# EAGLE design module_4dig7seg (EAGLE 9.6.2)
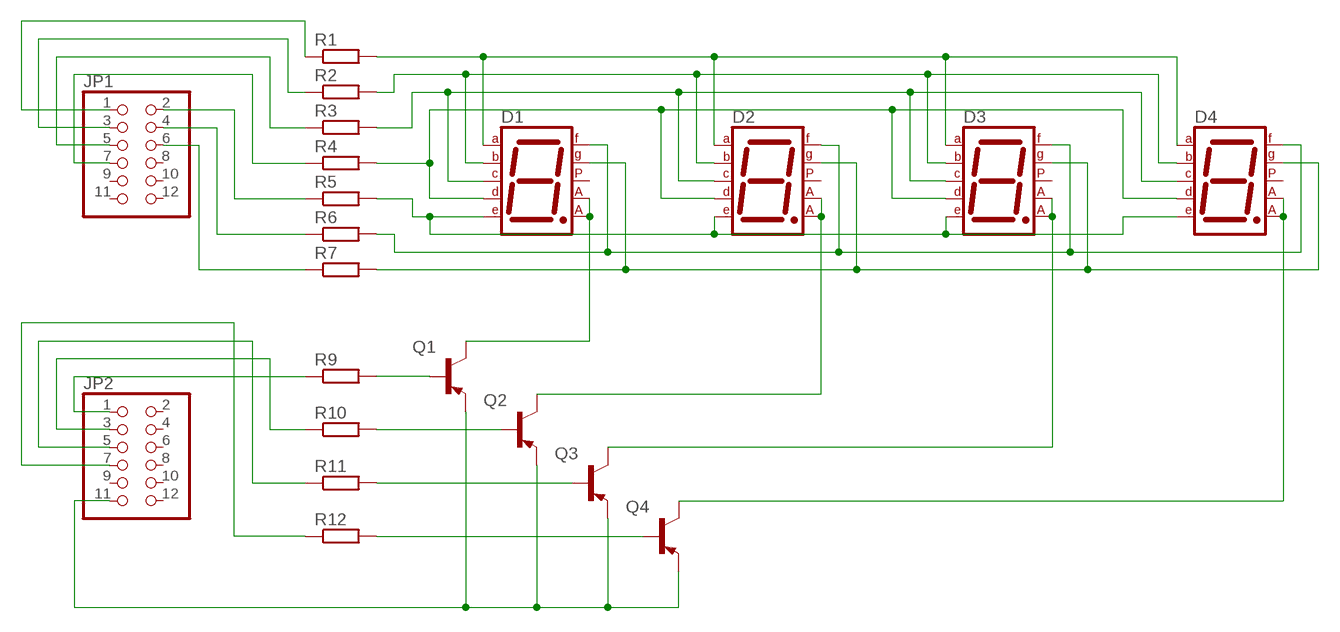
[diagram p0: schematic, sheet 1]

## Parts
D1  7SEG-CA  [7SEG-13]
D2  7SEG-CA  [7SEG-13]
D3  7SEG-CA  [7SEG-13]
D4  7SEG-CA  [7SEG-13]
JP1  PINHD-2X6/90  [2X06/90]
JP2  PINHD-2X6/90  [2X06/90]
Q1  2N3906  [TO92]
Q2  2N3906  [TO92]
Q3  2N3906  [TO92]
Q4  2N3906  [TO92]
R1  R-EU_0204/7  [0204/7]
R2  R-EU_0204/7  [0204/7]
R3  R-EU_0204/7  [0204/7]
R4  R-EU_0204/7  [0204/7]
R5  R-EU_0204/7  [0204/7]
R6  R-EU_0204/7  [0204/7]
R7  R-EU_0204/7  [0204/7]
R9  R-EU_0204/7  [0204/7]
R10  R-EU_0204/7  [0204/7]
R11  R-EU_0204/7  [0204/7]
R12  R-EU_0204/7  [0204/7]

## Nets
N$1: Q1.2(B) R9.2
N$2: Q2.2(B) R10.2
N$3: Q3.2(B) R11.2
N$4: Q4.2(B) R12.2
N$5: JP2.7 R12.1
N$6: JP2.1 R9.1
N$7: JP2.3 R10.1
N$8: JP2.5 R11.1
N$9: JP2.11 Q1.3(E) Q2.3(E) Q3.3(E) Q4.3(E)
N$10: JP1.7 R4.1
N$11: JP1.5 R3.1
N$12: JP1.3 R2.1
N$13: JP1.1 R1.1
N$14: JP1.2 R5.1
N$15: JP1.4 R6.1
N$16: JP1.6 R7.1
N$17: D1.3(CA1) D1.8(CA2) Q1.1(C)
N$18: D1.7(A) D2.7(A) D3.7(A) D4.7(A) R1.2
N$19: D3.3(CA1) D3.8(CA2) Q3.1(C)
N$20: D1.2(D) D2.2(D) D3.2(D) D4.2(D) R4.2
N$21: D1.4(C) D2.4(C) D3.4(C) D4.4(C) R3.2
N$22: D1.1(E) D2.1(E) D3.1(E) D4.1(E) R5.2
N$23: D1.9(F) D2.9(F) D3.9(F) D4.9(F) R6.2
N$24: D1.6(B) D2.6(B) D3.6(B) D4.6(B) R2.2
N$27: D1.10(G) D2.10(G) D3.10(G) D4.10(G) R7.2
N$28: D2.3(CA1) D2.8(CA2) Q2.1(C)
N$30: D4.3(CA1) D4.8(CA2) Q4.1(C)
Unconnected: D1.5(DP) D2.5(DP) D3.5(DP) D4.5(DP) JP1.8 JP1.9 JP1.10 JP1.11 JP1.12 JP2.2 JP2.4 JP2.6 JP2.8 JP2.9 JP2.10 JP2.12

## Library data of the parts
D1-D4 = special:7SEG-CA: 7-segment DISPLAY single anode, 13 mm
JP1 JP2 = pinhead:PINHD-2X6: PIN HEADER
Q1-Q4 = transistor-pnp:2N3906: PNP Transistor
R1-R7 R9-R12 = rcl:R-EU_: RESISTOR, European symbol; SPICEPREFIX: R

## Board
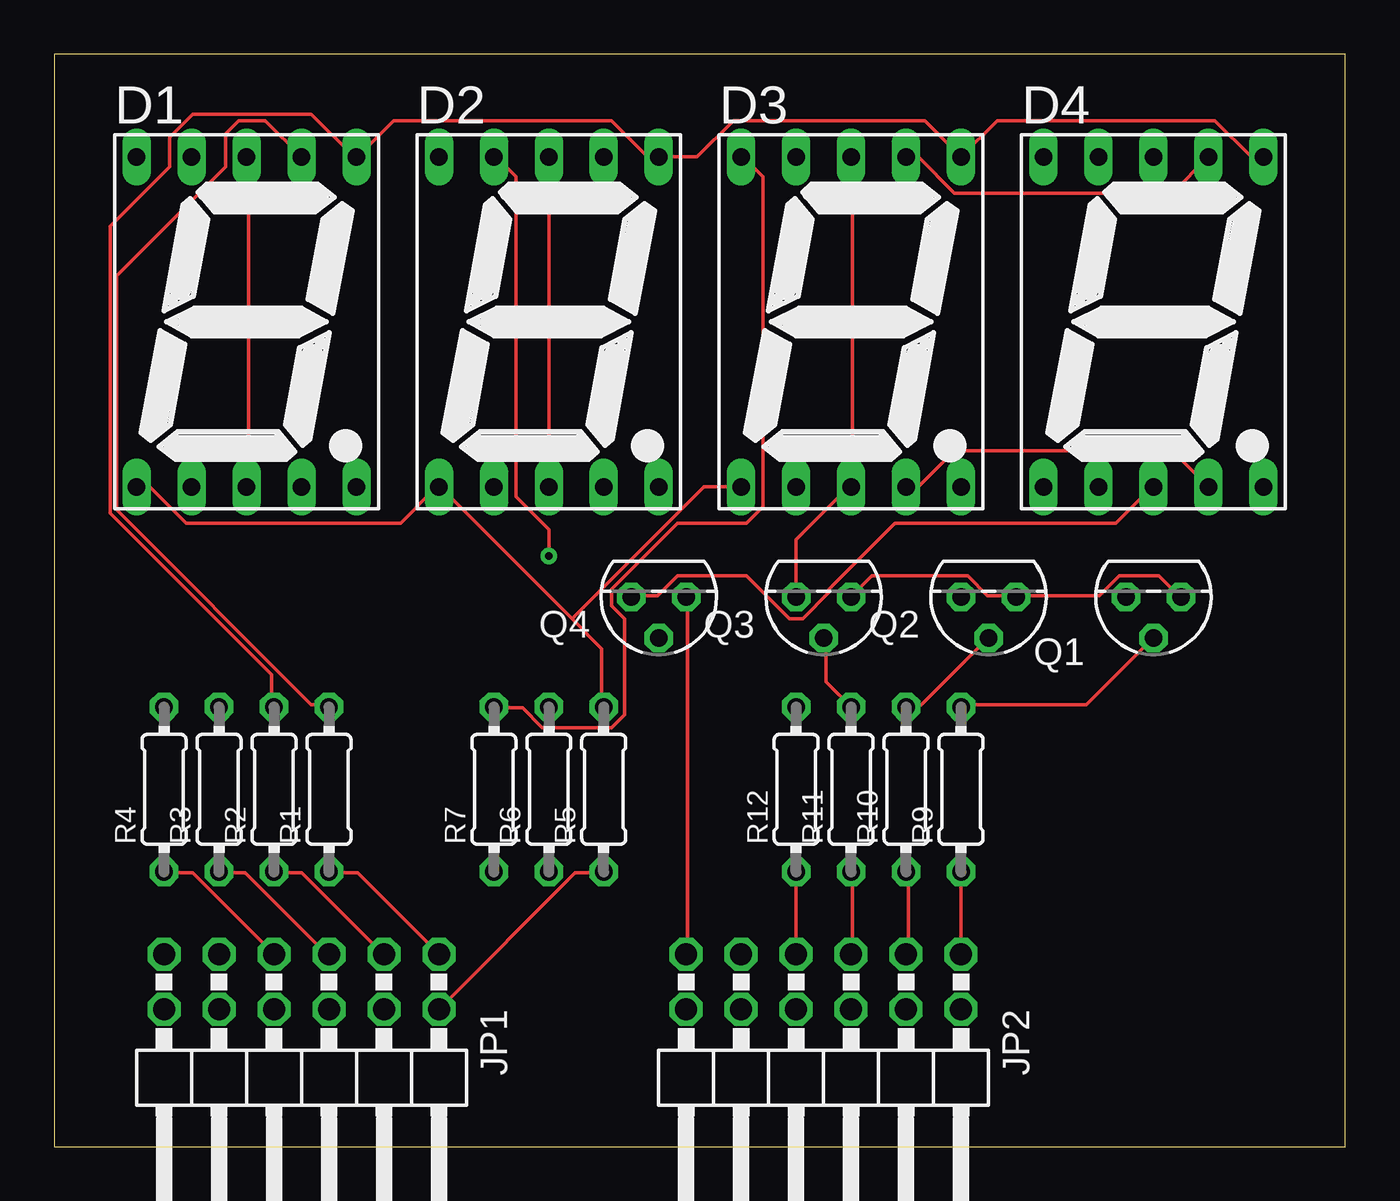
[diagram p1: board, top side]
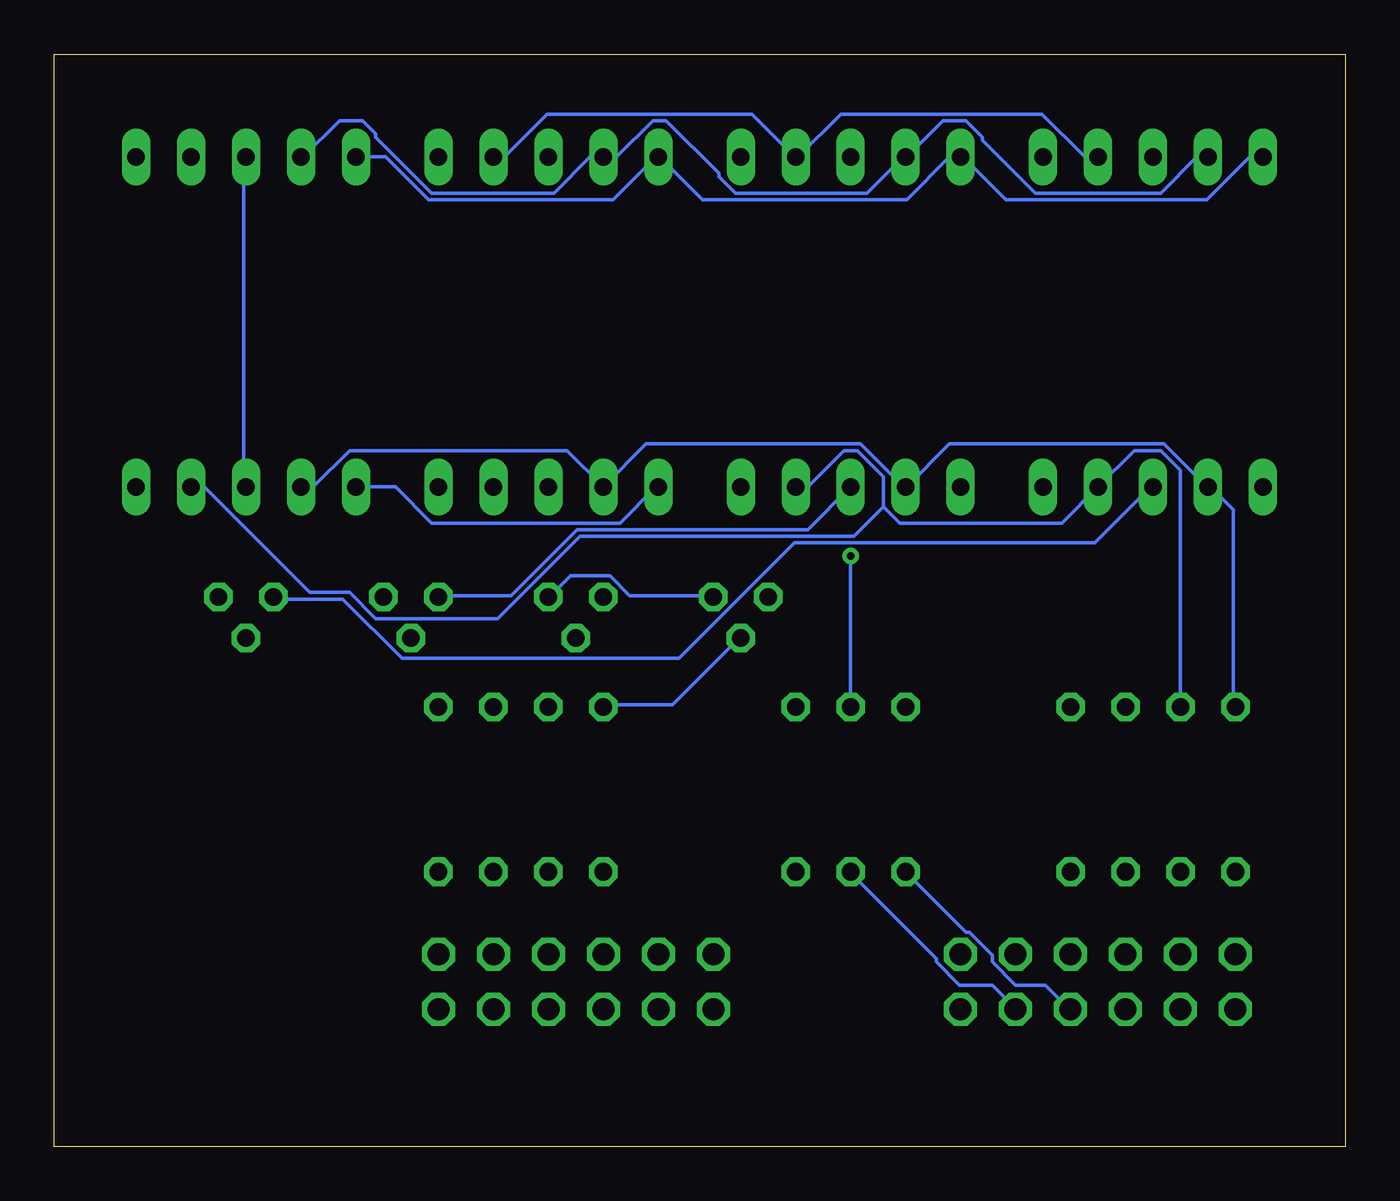
[diagram p2: board, bottom side, seen from below]

Size 59.67 x 50.47 mm. Coordinates in mm from the lower left corner, seen from the top.
Outline: 0,0 59.67,0 59.67,50.47 0,50.47 0,0
Copper layers (1*16): Top 0.035mm / dielectric 1.5mm / Bottom 0.035mm
Design rules "default": minimum track width 6mil, minimum drill 0.35mm, track to track 6mil, track to pad 6mil, pad to pad 6mil, via to via 6mil, smd to smd 6mil, copper to edge 40mil, drill to drill 6mil, minimum pad ring 10mil, minimum via ring 8mil, stop-mask expansion 4mil, vias tented up to drill 0mil, thermal gap 10mil

### Footprints (pad centres in the part's own frame; a part is rotated, then mirrored left to right if it is on the bottom)
7SEG-13 = drill 0.813 long: 1 -5.08,-7.62; 2 -2.54,-7.62; 3 0,-7.62; 4 2.54,-7.62; 5 5.08,-7.62; 6 5.08,7.62; 7 2.54,7.62; 8 0,7.62; 9 -2.54,7.62; 10 -5.08,7.62
2X06/90 = drill 1.016 octagon: 1 -6.35,-6.35; 2 -6.35,-3.81; 3 -3.81,-6.35; 4 -3.81,-3.81; 5 -1.27,-6.35; 6 -1.27,-3.81; 7 1.27,-6.35; 8 1.27,-3.81; 9 3.81,-6.35; 10 3.81,-3.81; 11 6.35,-6.35; 12 6.35,-3.81
TO92 = drill 0.813 octagon: 1 1.27,0; 2 0,1.905; 3 -1.27,0
0204/7 = drill 0.813 octagon: 1 -3.81,0; 2 3.81,0

### Placement (x,y rotation side)
D1  8.89,38.1 0 top
D2  22.86,38.1 0 top
D3  36.83,38.1 0 top
D4  50.8,38.1 0 top
JP1  11.43,2.54 180 top
JP2  35.56,2.54 180 top
Q1  50.8,25.4 180 top
Q2  43.18,25.4 180 top
Q3  35.56,25.4 180 top
Q4  27.94,25.4 180 top
R1  12.7,16.51 90 top
R2  10.16,16.51 90 top
R3  7.62,16.51 90 top
R4  5.08,16.51 90 top
R5  25.4,16.51 90 top
R6  22.86,16.51 90 top
R7  20.32,16.51 90 top
R9  41.91,16.51 90 top
R10  39.37,16.51 90 top
R11  36.83,16.51 90 top
R12  34.29,16.51 90 top

### Tracks (layer width: path | path; a pad name or v marks a point on that pad's centre or on a via)
N$1
  Top 0.152: R9.2 41.91,20.42 47.7,20.42 50.75,23.47 Q1.2
N$2
  Top 0.152: R10.2 39.47,20.42 40.08,20.42 43.13,23.47 Q2.2
N$3
  Top 0.152: R11.2 35.66,21.49 35.66,23.47 Q3.2
N$4
  Bottom 0.152: R12.2 34.29,20.42 31.09,20.42 28.04,23.47 Q4.2
N$5
  Top 0.152: JP2.7 R12.1
N$6
  Top 0.152: JP2.1 R9.1
N$7
  Top 0.152: R10.1 39.47,12.65 39.47,8.99 JP2.3
N$8
  Top 0.152: R11.1 36.88,12.65 36.88,8.99 JP2.5
N$9
  Top 0.152: Q1.3 51.97,25.45 51.05,26.36 49.23,26.36 48.31,25.45 44.5,25.45 Q2.3 44.35,25.45 43.13,25.45 42.22,26.36 37.8,26.36 Q3.3 | JP2.11 29.26,8.99 29.26,25.3 Q4.3
  Bottom 0.152: Q4.3 29.26,25.45 33.07,25.45 33.98,26.36 35.81,26.36 36.73,25.45 Q3.3
N$10
  Top 0.152: JP1.7 6.4,12.65 5.18,12.65 R4.1
N$11
  Top 0.152: R3.1 7.62,12.65 8.84,12.65 12.65,8.84 JP1.5
N$12
  Top 0.152: R2.1 10.21,12.65 11.43,12.65 15.24,8.84 JP1.3
N$13
  Top 0.152: JP1.1 14.02,12.65 12.8,12.65 R1.1
N$14
  Top 0.152: JP1.2 24.08,12.65 25.3,12.65 R5.1
N$15
  Bottom 0.152: R6.1 22.86,12.65 18.9,8.69 18.9,8.53 17.83,7.47 16.31,7.47 15.24,6.4 JP1.4
N$16
  Bottom 0.152: R7.1 17.53,9.91 17.37,9.91 16.31,8.84 16.31,8.53 15.24,7.47 13.87,7.47 12.8,6.4 JP1.6
N$17
  Top 0.152: D1.3 8.99,30.48 8.99,45.72 D1.8
  Bottom 0.152: Q1.1 49.53,25.3 46.33,25.3 43.59,22.55 30.79,22.55 25.45,27.89 11.58,27.89 8.99,30.48 D1.3
N$18
  Top 0.152: D3.7 39.93,45.72 41.6,44.04 51.66,44.04 D4.7 | D1.7 9.75,47.4 8.53,47.4 7.92,46.79 7.92,45.26 2.9,40.23 2.9,29.41 11.89,20.42 12.65,20.42 R1.2
  Bottom 0.152: D1.7 12.04,45.72 14.02,47.7 23.32,47.7 25.3,45.72 D2.7 25.45,45.72 27.43,47.7 36.88,47.7 38.86,45.72 D3.7
N$19
  Top 0.152: Q3.1 34.29,28.04 36.73,30.48 D3.3 36.88,30.48 36.88,45.72 D3.8
N$20
  Bottom 0.152: R4.2 5.18,20.42 5.18,29.41 6.25,30.48 D1.2 6.4,30.48 8.38,32.46 18.29,32.46 20.27,30.48 D2.2 20.42,30.48 22.4,32.46 32.31,32.46 D3.2 35.97,32.16 46.02,32.16 47.7,30.48 D4.2
N$21
  Top 0.152: D3.4 39.93,30.48 41.6,32.16 51.66,32.16 D4.4
  Bottom 0.152: R3.2 7.62,31.24 8.53,32.16 9.75,32.16 D1.4 13.11,28.8 20.57,28.8 21.34,29.57 | D2.4 24.84,30.48 23.16,32.16 22.55,32.16 21.34,30.94 21.34,29.57 | D4.4 52.73,30.48 47.85,25.6 46.02,25.6 44.81,24.38 39.17,24.38 35.36,28.19 22.71,28.19 21.34,29.57
N$22
  Top 0.152: 23.93,24.38 17.83,30.48 D2.1 17.68,30.48 16,28.8 6.1,28.8 4.42,30.48 D1.1 | 23.93,24.38 25.3,23.01 25.3,20.42 R5.2 | D3.1 30.02,30.48 23.93,24.38
  Bottom 0.152: D4.1 43.89,30.48 42.22,28.8 33.53,28.8 31.85,30.48 D3.1
N$23  (via drill 0.35)
  Top 0.152: v22.86,27.28 22.86,28.5 21.34,30.02 21.34,44.81 20.42,45.72 D2.9
  Bottom 0.152: D4.9 48.16,45.72 46.48,47.4 45.41,47.4 44.81,46.79 44.81,46.63 42.22,44.04 36.58,44.04 34.9,45.72 D3.9 33.68,45.72 32,47.4 31.39,47.4 28.96,44.96 28.96,44.81 28.19,44.04 22.1,44.04 20.42,45.72 D2.9 20.27,45.72 18.59,47.4 17.53,47.4 16.76,46.63 16.76,46.48 14.33,44.04 8.53,44.04 6.86,45.72 D1.9 | v22.86,27.28 R6.2
N$24
  Top 0.152: D4.6 55.32,45.72 53.65,47.4 43.59,47.4 D3.6 40.23,47.4 31.39,47.4 29.72,45.72 D2.6 27.43,45.72 25.76,47.4 15.7,47.4 14.02,45.72 D1.6 13.87,45.72 11.89,47.7 6.4,47.7 5.33,46.63 5.33,45.26 2.59,42.52 2.59,29.26 10.06,21.79 10.06,20.42 R2.2
N$27
  Top 0.152: R7.2 20.42,20.27 21.64,20.27 22.55,19.36 25.76,19.36 26.36,19.96 26.36,24.38 25.76,24.99 25.76,25.76 28.8,28.8 32,28.8 32.77,29.57 32.77,44.81 31.85,45.72 D3.10
  Bottom 0.152: D1.10 4.42,45.72 6.4,43.74 15.7,43.74 17.68,45.72 D2.10 18.29,45.72 20.27,43.74 29.72,43.74 31.7,45.72 D3.10 31.85,45.72 33.83,43.74 42.37,43.74 44.35,45.72 D4.10
N$28
  Top 0.152: D2.3 D2.8
  Bottom 0.152: D2.3 24.84,28.5 35.51,28.5 38.56,25.45 41.91,25.45 Q2.1
N$30
  Top 0.152: Q4.1 26.67,25.45 27.89,25.45 28.8,26.36 32,26.36 33.98,24.38 34.59,24.38 35.81,25.6 35.81,25.76 38.86,28.8 49.07,28.8 50.75,30.48 D4.3
  Bottom 0.152: D4.8 50.9,45.72 50.9,30.48 D4.3